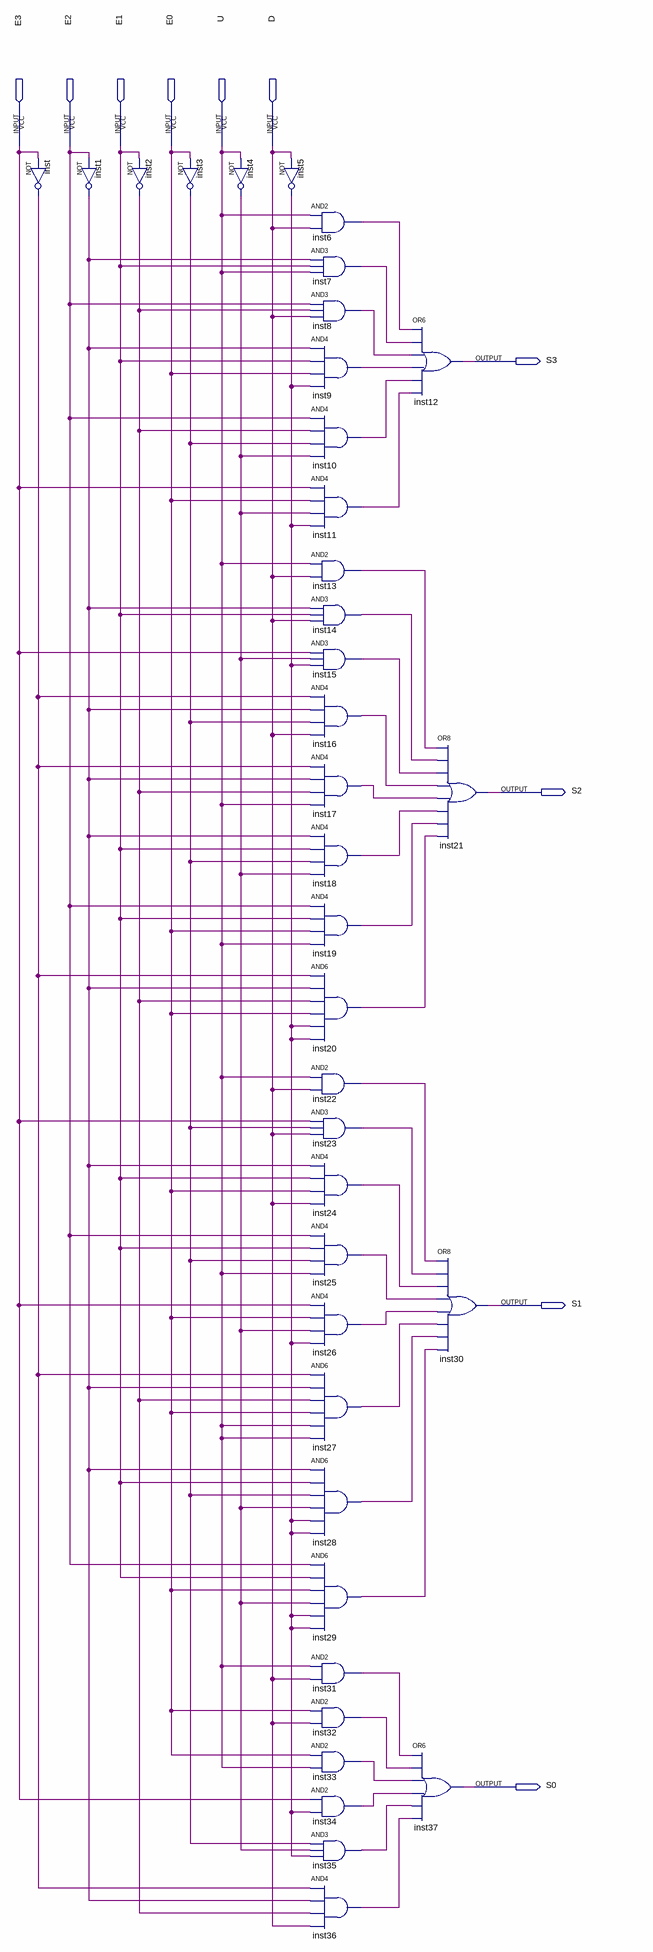
[diagram p0: schematic sheet]
// Quartus schematic Saida.bdf as structural Verilog: 38 symbols, 10 pins
module Saida (
  input  E3,
  input  E2,
  input  E1,
  input  E0,
  input  U,
  input  D,
  output S3,
  output S2,
  output S1,
  output S0
);

  wire inst1_out, inst2_out, inst3_out, inst4_out, inst5_out, inst6_out, inst7_out, inst8_out, inst9_out,
       inst10_out, inst11_out, inst13_out, inst14_out, inst15_out, inst16_out, inst17_out, inst18_out,
       inst19_out, inst20_out, inst22_out, inst23_out, inst24_out, inst25_out, inst26_out, inst27_out,
       inst28_out, inst29_out, inst31_out, inst32_out, inst33_out, inst34_out, inst35_out, inst36_out,
       inst_out;

  not inst (inst_out, E3);
  not inst1 (inst1_out, E2);
  not inst2 (inst2_out, E1);
  not inst3 (inst3_out, E0);
  not inst4 (inst4_out, U);
  not inst5 (inst5_out, D);
  and inst6 (inst6_out, U, D);
  and inst7 (inst7_out, inst1_out, E1, U);
  and inst8 (inst8_out, E2, inst2_out, D);
  and inst9 (inst9_out, inst1_out, E1, E0, inst5_out);
  and inst10 (inst10_out, E2, inst2_out, inst3_out, inst4_out);
  and inst11 (inst11_out, E3, E0, inst4_out, inst5_out);
  and inst13 (inst13_out, U, D);
  and inst14 (inst14_out, inst1_out, E1, D);
  and inst15 (inst15_out, E3, inst4_out, inst5_out);
  and inst16 (inst16_out, inst_out, inst1_out, inst3_out, D);
  and inst17 (inst17_out, inst_out, inst1_out, inst2_out, U);
  and inst18 (inst18_out, inst1_out, E1, inst3_out, inst4_out);
  and inst19 (inst19_out, E2, E1, E0, U);
  and inst20 (inst20_out, inst_out, inst1_out, inst2_out, E0, inst5_out, inst5_out);
  and inst22 (inst22_out, U, D);
  and inst23 (inst23_out, E3, inst3_out, D);
  and inst24 (inst24_out, inst1_out, E1, E0, D);
  and inst25 (inst25_out, E2, E1, inst3_out, U);
  and inst26 (inst26_out, E3, E0, inst4_out, inst5_out);
  and inst27 (inst27_out, inst_out, inst1_out, inst2_out, E0, U, U);
  and inst28 (inst28_out, inst1_out, E1, inst3_out, inst4_out, inst5_out, inst5_out);
  and inst29 (inst29_out, E2, E1, E0, inst4_out, inst5_out, inst5_out);
  and inst31 (inst31_out, U, D);
  and inst32 (inst32_out, E0, D);
  and inst33 (inst33_out, E0, U);
  and inst34 (inst34_out, E3, inst5_out);
  and inst35 (inst35_out, inst3_out, inst4_out, inst5_out);
  and inst36 (inst36_out, inst_out, inst1_out, inst2_out, D);
  or inst12 (S3, inst6_out, inst7_out, inst8_out, inst9_out, inst10_out, inst11_out);
  or inst37 (S0, inst31_out, inst32_out, inst33_out, inst34_out, inst35_out, inst36_out);
  or inst21 (S2, inst13_out, inst14_out, inst15_out, inst16_out, inst17_out, inst18_out, inst19_out, inst20_out);
  or inst30 (S1, inst22_out, inst23_out, inst24_out, inst25_out, inst26_out, inst27_out, inst28_out, inst29_out);
endmodule
